# Altium project lazer-sensor-for-trespassers.PrjPcb
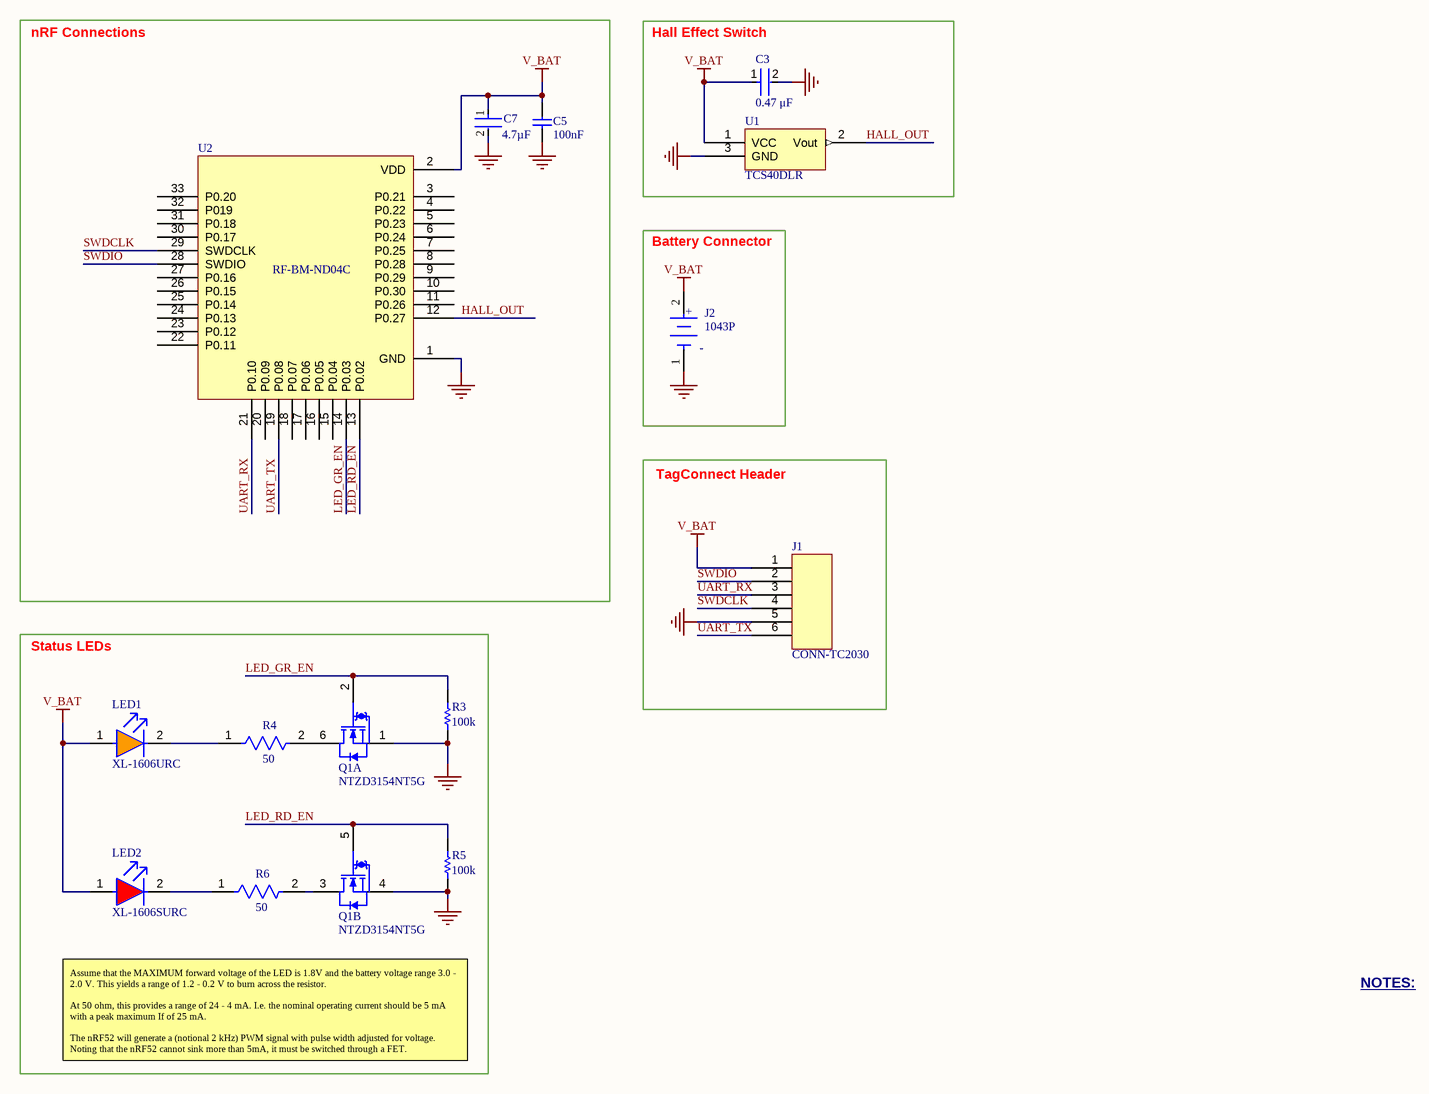
[diagram p0: rizzler-hall-sensor-board.SchDoc]
1 sheet, 14 parts. Net scope: global (net labels, ports and power ports of the same name join across sheets).
Board file: rizzler-hall-sensor-board.PcbDoc

## Sheet rizzler-hall-sensor-board.SchDoc: BT MCU
size 420 x 297 mm; DocumentNumber: 999999-EL-SCH-0001; SheetNumber: 1; SheetTotal: 1; CLIENT_PROJECT_NAME: Rizzler Hall Sensor Board; COPYRIGHT_OWNER: DAENA PTY LTD; COPYRIGHT_YEAR: 2023

### Parts
C3  value 0.47 μF  [FP-C0805C-DN-MFG]  (hidden comment: C0805C474K3RACTU)
C5  100nF  [CAPC0603X03L_C]
C7  Capacitance: 4.7µF  [FP-GRM188-0_15-MFG]  (hidden comment: GRM188R61C475KAAJD)
J1  CONN-TC2030  [TC2030-IDC-PLUG-OF-NAILS-TIGHT]
J2  1043P  [FP-1043P-MFG]
LED1  XL-1606URC  [LED-RA-1606]
LED2  XL-1606SURC  [LED-RA-1606]
Q1  NTZD3154NT5G  [ONSC-SOT-563-6-463A-01_V]  (parts A,B of 2)
R3  value 100k  [RESC1005X40X25ML05T10]  (hidden comment: RC0402FR-07100KL)
R4  Resistance: 50  [FP-AC0402-IPC_C]  (hidden comment: AC0402JR-0750RL)
R5  value 100k  [RESC1005X40X25ML05T10]  (hidden comment: RC0402FR-07100KL)
R6  Resistance: 50  [FP-AC0402-IPC_C]  (hidden comment: AC0402JR-0750RL)
U1  TCS40DLR  [SOT95P245X80-3N]
U2  RF-BM-ND04C  [RF-BM-ND04]

### Blocks framed on the sheet
nRF Connections: C5 C7 U2
Hall Effect Switch: C3 U1
Battery Connector: J2
TagConnect Header: J1
Status LEDs: LED1 LED2 Q1 R3-R6

### Nets
GND: C3.2 C5.2 C7.2 J1.5 J2.1(C) Q1.1(S1) Q1.4(S2) R3.1 R5.1 U1.3(GND) U2.1(GND)
V_BAT: C3.1 C5.1 C7.1 J1.1 J2.2(A) LED1.1(A) LED2.1(A) U1.1(VCC) U2.2(VDD)
HALL_OUT: U1.2(Vout) U2.12(P0.27)
LED_GR_EN: Q1.2(G1) R3.2 U2.14(P0.03)
LED_RD_EN: Q1.5(G2) R5.2 U2.13(P0.02)
SWDCLK: J1.4 U2.29(SWDCLK)
SWDIO: J1.2 U2.28(SWDIO)
UART_RX: J1.3 U2.21(P0.10)
UART_TX: J1.6 U2.19(P0.08)
NetLED1_2: LED1.2(C) R4.1
NetLED2_2: LED2.2(C) R6.1
NetQ1_3: Q1.3(D2) R6.2
NetQ1_6: Q1.6(D1) R4.2

Not connected (* = marked no-connect by the designer): U2 3(P0.21) 4(P0.22) 5(P0.23) 6(P0.24) 7(P0.25) 8(P0.28) 9(P0.29) 10(P0.30) 11(P0.26) 15(P0.04) 16(P0.05) 17(P0.06) 18(P0.07) 20(P0.09) 22(P0.11) 23(P0.12) 24(P0.13) 25(P0.14) 26(P0.15) 27(P0.16) 30(P0.17) 31(P0.18) 32(P019) 33(P0.20)

### Notes on the sheet
- NOTES:
- Assume that the MAXIMUM forward voltage of the LED is 1.8V and the battery voltage range 3.0 - 2.0 V. This yields a range of 1.2 - 0.2 V to burn across the resistor.
  At 50 ohm, this provides a range of 24 - 4 mA. I.e. the nominal operating current should be 5 mA with a peak maximum If of 25 mA.
  The nRF52 will generate a (notional 2 kHz) PWM signal with pulse width adjusted for voltage. Noting that the nRF52 cannot sink more than 5mA, it must be switched through a FET.
- THIS DOCUMENT AND THE DATA DISCLOSED HEREIN OR
- DWG NO:
- REV:
- MAY NOT BE DISTRIBUTED IN PART OR WHOLE WITHOUT PRIOR
- ENG:
- DSN:
- APPROVALS
- DATE
- SCALE:
- A3
- SIZE
- DWG NO.
- SHEET
- OF
- REV
- CHK:
- (in symbol CMP-19636-000034-1) +

### Library data of the parts
C3 = CMP-1036-04645-2: CAP CER 0.47UF 25V X7R 0805; Manufacturer: KEMET; Material: Ceramic; Tolerance: 0.1; Temperature Coefficient: 30ppm/°C; Lead Free: Yes; Device Class L1: Passive Components; ComponentLink2Description: Datasheet; Category: Cap; Temperature: -55°C to +125°C; RoHS: TRUE; Capacitance: 0.47 μF; Automotive: No; Height: 0.88mm; Digikey Description: CAP CER 0.47UF 25V X7R 0805; Manufacturer Part Number: C0805C474K3RACTU; Device Class L3: Ceramic Capacitors; Package: C0805C-DN; Voltage Rating: 25 V; Octopart: https://octopart.com/c0805c474k3ractu-kemet-90785; Temperature Characteristic: X7R; Temperature Range Low: -55°C; Temperature Range High: +125°C; Device Class L2: Capacitors; Ipc Land Pattern Name: CAPC200125X78; ComponentLink2URL: https://content.kemet.com/datasheets/KEM_C1003_C0G_SMD.pdf
C5 = C0201-100n: Capacitor, X5R, ±10%; Part Number: C0201-100n; Manufacturer: *; Manufacturer Part Number: *; LatestRevisionDate: 2017-11-09; Pin Count: 2; Publisher: Nordic Semiconductor; Published: 2014-11-13; Value: 100nF; Footprint Doc: 0201
C7 = CMP-06035-062935-2: CAP CER 4.7UF 16V X5R 0603; NexarPartId: 20311162; Material: Ceramic; Tolerance: 10%; Lead Free: Lead Free; Weight: 6.293594mg; Max Operating Temperature: 85°C; Thickness: 939.8µm; RoHS: Compliant; Case Code (Imperial): 0603; Case Code (Metric): 1608; Depth: 800µm; Schedule B: 8532240020; Width: 800µm; Lifecycle Status: Production; Voltage Rating: 16V; REACH SVHC: No SVHC; Height: 800µm; Case/Package: 0603; Voltage Rating (DC): 16V; Mount: Surface Mount; Dielectric: X5R; Termination: SMD/SMT; Packaging: Tape & Reel (TR); Length: 1.6mm; Min Operating Temperature: -55°C
J1 = CONN-TC2030: TC2030 PLUG-OF-NAILS CABLE
J2 = CMP-19636-000034-1: BATT HOLDER 18650 1 CELL PC PIN; Number of Cells: 1; Series: -; Termination: PC Pin; Package Quantity: 50; Min Operating Temperature: -50°C; Mount: Through Hole; Packaging: Tray; Max Operating Temperature: 145°C
LED1 = LED-ORANGE-RA: Orange LED 90° mount
LED2 = LED-RED-RA: Red LED 90° mount
Q1 = CMP-1058-00829-1: Small Signal MOSFET, 20 V, 540 mA, Dual N-Channel, 6-Pin SOT-563, Pb-Free, Tape and Reel; Manufacturer: On Semiconductor; VGS Max (V): 6; ID Max (A): 0.54; Channel Polarity: N Channel; VGS(th) Max (V): 1; V(BR)DSS Min (V): 20; Ciss Typ (pF): 80; Crss Typ (pF): 10; Coss Typ (pF): 13; Mounting Technology: Surface Mount; DatasheetVersion: Rev. 2; Package Type: SOT-563; ComponentLink2Description: Datasheet; PartNumber: NTZD3154NT5G; RoHS: Pb-Free; Packing: Tape and Reel; ComponentLink1URL: http://www.onsemi.com/; PackageReference: SOT-563-6-463A-01; ComponentLink2URL: http://www.onsemi.com/pub_link/Collateral/NTZD3154N-D.PDF; Configuration: Dual; ComponentLink1Description: Manufacturer URL; ComponentLink3Description: Package Specification; PackageVersion: Rev. F, 04/2005; ComponentLink3URL: http://www.onsemi.cn/pub_link/Collateral/463A-01.PDF; PackageDescription: 6-Pin Small Outline Transistor, Body 1.6 x 1.2 mm, Pitch 0.5 mm
R3 R5 = CMP-2002-07343-1: Manufacturer: Yageo / Phycomp; Part Number: RC0402FR-07100KL
R4 R6 = CMP-2002-01779-2: RES 50Ω ±5% 0.063W 0402; Voltage Rating: 50V; Power Rating: 62.5mW; Max Power Dissipation: 63mW; Temperature Coefficient: 100ppm/°C; Termination: SMD/SMT; Packaging: Tape and Reel; Case Code (Metric): 1005; Min Operating Temperature: -55°C; Case/Package: 0402; Length: 0.039inch; Series: AC; Number of Terminations: 2; Weight: 2.3E-05oz; Tolerance: 5%; Max Operating Temperature: 155°C; Features: Moisture Resistant; Width: 0.5mm; Height: 0.015inch; Resistor Type: Thick Film; Lead Free: Lead Free; Case Code (Imperial): 0402; RoHS Compliant: Yes
U1 = IC-HALL-TCS40DLR: Digital-Output Magnetic Sensor (Hall IC). Open drain.
U2 = RF-BM-ND04C: nRF52810-based Bluetooth 5.0 Low Energy module with internal 32 MHz and 32.768 kHz crystals.